# Altium schematic sheet Underglow.SchDoc
size A4; DocumentNumber: 2; SheetNumber: 2; SheetTotal: 3
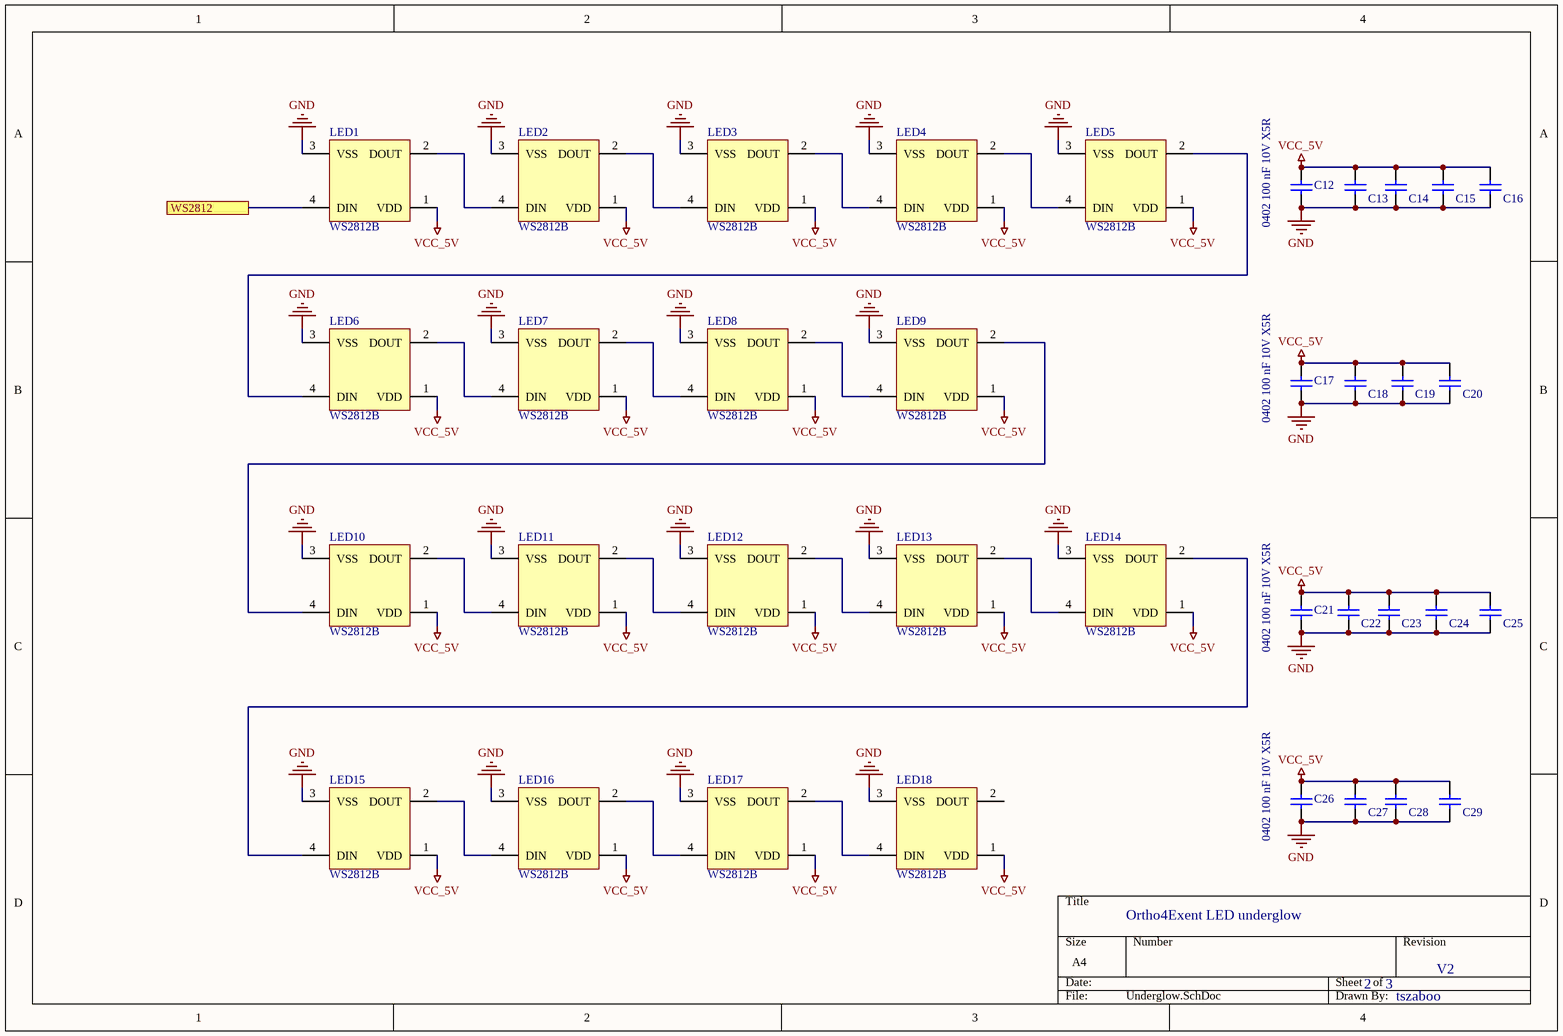
[diagram p0: Underglow.SchDoc]

## Parts
C12  SCH: 0402 100 nF 10V X5R  [CAPC0402N]  (hidden comment: 0402 100nF)
C13  0402 100nF  [CAPC0402N]  (value not drawn)
C14  0402 100nF  [CAPC0402N]  (value not drawn)
C15  0402 100nF  [CAPC0402N]  (value not drawn)
C16  0402 100nF  [CAPC0402N]  (value not drawn)
C17  SCH: 0402 100 nF 10V X5R  [CAPC0402N]  (hidden comment: 0402 100nF)
C18  0402 100nF  [CAPC0402N]  (value not drawn)
C19  0402 100nF  [CAPC0402N]  (value not drawn)
C20  0402 100nF  [CAPC0402N]  (value not drawn)
C21  SCH: 0402 100 nF 10V X5R  [CAPC0402N]  (hidden comment: 0402 100nF)
C22  0402 100nF  [CAPC0402N]  (value not drawn)
C23  0402 100nF  [CAPC0402N]  (value not drawn)
C24  0402 100nF  [CAPC0402N]  (value not drawn)
C25  0402 100nF  [CAPC0402N]  (value not drawn)
C26  SCH: 0402 100 nF 10V X5R  [CAPC0402N]  (hidden comment: 0402 100nF)
C27  0402 100nF  [CAPC0402N]  (value not drawn)
C28  0402 100nF  [CAPC0402N]  (value not drawn)
C29  0402 100nF  [CAPC0402N]  (value not drawn)
LED1  WS2812B  [WS2812]
LED2  WS2812B  [WS2812]
LED3  WS2812B  [WS2812]
LED4  WS2812B  [WS2812]
LED5  WS2812B  [WS2812]
LED6  WS2812B  [WS2812]
LED7  WS2812B  [WS2812]
LED8  WS2812B  [WS2812]
LED9  WS2812B  [WS2812]
LED10  WS2812B  [WS2812]
LED11  WS2812B  [WS2812]
LED12  WS2812B  [WS2812]
LED13  WS2812B  [WS2812]
LED14  WS2812B  [WS2812]
LED15  WS2812B  [WS2812]
LED16  WS2812B  [WS2812]
LED17  WS2812B  [WS2812]
LED18  WS2812B  [WS2812]

## Ports
WS2812

## Nets
GND: C12.1 C13.1 C14.1 C15.1 C16.1 C17.1 C18.1 C19.1 C20.1 C21.1 C22.1 C23.1 C24.1 C25.1 C26.1 C27.1 C28.1 C29.1 LED1.3(VSS) LED2.3(VSS) LED3.3(VSS) LED4.3(VSS) LED5.3(VSS) LED6.3(VSS) LED7.3(VSS) LED8.3(VSS) LED9.3(VSS) LED10.3(VSS) LED11.3(VSS) LED12.3(VSS) LED13.3(VSS) LED14.3(VSS) LED15.3(VSS) LED16.3(VSS) LED17.3(VSS) LED18.3(VSS)
VCC_5V: C12.2 C13.2 C14.2 C15.2 C16.2 C17.2 C18.2 C19.2 C20.2 C21.2 C22.2 C23.2 C24.2 C25.2 C26.2 C27.2 C28.2 C29.2 LED1.1(VDD) LED2.1(VDD) LED3.1(VDD) LED4.1(VDD) LED5.1(VDD) LED6.1(VDD) LED7.1(VDD) LED8.1(VDD) LED9.1(VDD) LED10.1(VDD) LED11.1(VDD) LED12.1(VDD) LED13.1(VDD) LED14.1(VDD) LED15.1(VDD) LED16.1(VDD) LED17.1(VDD) LED18.1(VDD)
WS2812: LED1.4(DIN) ; port WS2812
NetLED1_2: LED1.2(DOUT) LED2.4(DIN)
NetLED2_2: LED2.2(DOUT) LED3.4(DIN)
NetLED3_2: LED3.2(DOUT) LED4.4(DIN)
NetLED4_2: LED4.2(DOUT) LED5.4(DIN)
NetLED5_2: LED5.2(DOUT) LED6.4(DIN)
NetLED6_2: LED6.2(DOUT) LED7.4(DIN)
NetLED7_2: LED7.2(DOUT) LED8.4(DIN)
NetLED8_2: LED8.2(DOUT) LED9.4(DIN)
NetLED9_2: LED9.2(DOUT) LED10.4(DIN)
NetLED10_2: LED10.2(DOUT) LED11.4(DIN)
NetLED11_2: LED11.2(DOUT) LED12.4(DIN)
NetLED12_2: LED12.2(DOUT) LED13.4(DIN)
NetLED13_2: LED13.2(DOUT) LED14.4(DIN)
NetLED14_2: LED14.2(DOUT) LED15.4(DIN)
NetLED15_2: LED15.2(DOUT) LED16.4(DIN)
NetLED16_2: LED16.2(DOUT) LED17.4(DIN)
NetLED17_2: LED17.2(DOUT) LED18.4(DIN)

Not connected (* = marked no-connect by the designer): LED18 2(DOUT)

## Notes on the sheet
- Ortho4Exent LED underglow
- 2
- 3
- V2
- tszaboo

## Library data of the parts
C12 C17 C21 C26 = 885012105010: MANUF: WE; DESCIPTION: CAP SMD 0402 100 nF 10V X5R; NoPins: 2; SUPPLY: SUB; VOLTAGE: 10; TECH: X5R; COMPATIBLES: True; MANUFCODE: 885012105010; DIGIKEY: 732-7487-2-ND; SMD: YES; VALUE: 100 nF
C13-C16 C18-C20 C22-C25 C27-C29 = 885012105010: MANUF: WE; SCH: 0402 100 nF 10V X5R; DESCIPTION: CAP SMD 0402 100 nF 10V X5R; NoPins: 2; SUPPLY: SUB; VOLTAGE: 10; TECH: X5R; COMPATIBLES: True; MANUFCODE: 885012105010; DIGIKEY: 732-7487-2-ND; SMD: YES; VALUE: 100 nF
LED1-LED18 = WS2812: MANUF: Worldsemi; DESCIPTION: ADDRESS LED RED/GRN/BLUE; NoPins: 4; COMPATIBLES: False; DIGIKEY: COM-16347; MANUFCODE: WS2812B